# EasyEDA Pro project ProPrj_Ideal Diode_2025-12-23.epro

# Schematic Schematic1
Board Name: Board1; Create Date: 2025-12-15; Page Name: P1; Project Name: Ideal Diode; Schematic Name: Schematic1; Update Date: 2025-12-15; Company: EasyEDA.com; Page Size: A4; Version: V1.0
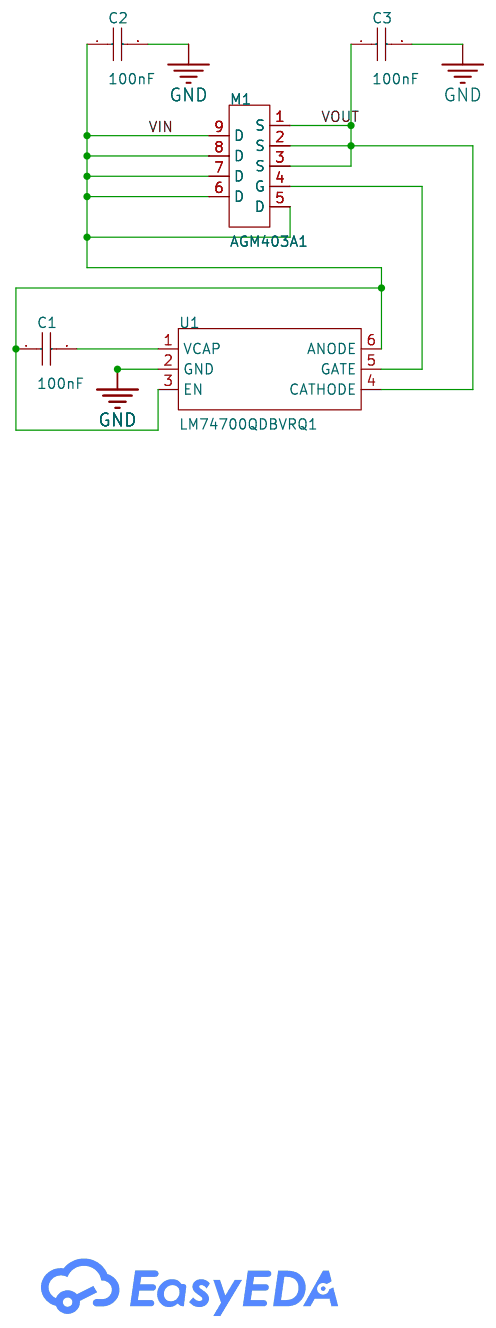
[diagram p0: schematic sheet]

## Parts
C1  100nF  [C0402]
C2  100nF  [C0402]
C3  100nF  [C0402]
M1  AGM403A1  [DFN-8_L5.8-W4.9-P1.27-LS6.0-BL-1]
U1  LM74700QDBVRQ1  [SOT-23-6_L2.9-W1.6-P0.95-LS2.8-BL]

## Library data of the parts
C1-C3 = 0402F104M500NT: Capacitance:100nF Tolerance:±20% Tolerance:±20% Voltage Rating:50V Temperature Coefficient:Y5V; LCSC Part Name: 100nF ±20% 50V; Supplier Part: C1581; Manufacturer: FH(风华); Supplier Footprint: 0402; JLCPCB Part Class: Extended Part; Datasheet: https://atta.szlcsc.com/upload/public/pdf/source/20200305/C486355_26A10D38EF8C2A5C37091D0039909270.pdf; Supplier: LCSC; Tolerance: ±20%; Voltage Rating: 50V; Temperature Coefficient: Y5V
M1 = AGM403A1: Number:1 N-Channel Drain to Source Voltage:40V Current - Continuous Drain(Id):120A RDS(on):2.3mΩ@10V Pd - Power Dissipation:83W Gate Threshold Voltage (Vgs(th)):1.6V@250uA Gate Charge(Qg):20nC@10V Input Capacitance(Ciss):5.189nF@20V Reverse Transfer Capac; LCSC Part Name: 1个N沟道 耐压:40V 电流:120A; Supplier Part: C5184861; Manufacturer: AGMSEMI(芯控源); Supplier Footprint: PDFN-8(5x6); JLCPCB Part Class: Extended Part; Datasheet: https://item.szlcsc.com/datasheet/AGM403A1/5851240.html; Supplier: LCSC; Number: 1 N-Channel; Drain to Source Voltage: 40V; Current - Continuous Drain(Id): 120A; RDS(on): 2.3mΩ@10V; Pd - Power Dissipation: 83W; Gate Threshold Voltage (Vgs(th)): 1.6V@250uA; Gate Charge(Qg): 20nC@10V; Input Capacitance(Ciss): 5.189nF@20V; Reverse Transfer Capacitance (Crss@Vds): 378pF@20V; Operating Temperature: -55℃~+150℃
U1 = LM74700QDBVRQ1_C2941042: LCSC Part Name: 低IQ电池反向保护理想二极管控制器; Supplier Part: C2941042; Manufacturer: TI(德州仪器); Supplier Footprint: SOT-23-6; JLCPCB Part Class: Extended Part; Datasheet: https://www.ti.com/cn/lit/gpn/lm74700-q1; Supplier: LCSC

## Nets
GND: C2.2 C3.2 U1.2(GND)
VIN: C1.1 C2.1 M1.5(D) M1.6(D) M1.7(D) M1.8(D) M1.9(D) U1.3(EN) U1.6(ANODE)
VOUT: C3.1 M1.1(S) M1.2(S) M1.3(S) U1.4(CATHODE)
$1N889: M1.4(G) U1.5(GATE)
$1N950: C1.2 U1.1(VCAP)

# Board PCB1
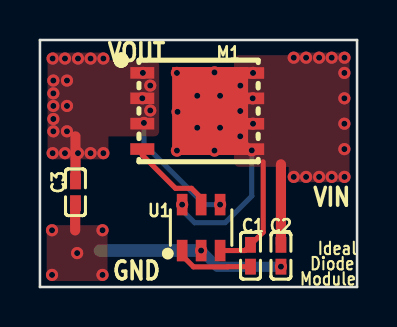
[diagram p1: board, top side]
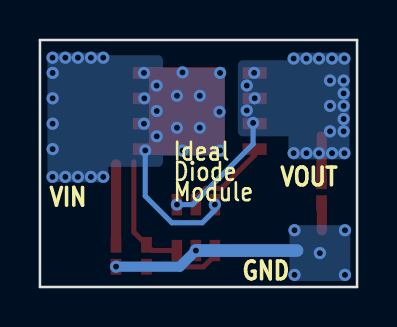
[diagram p2: board, bottom side, seen from below]

Outline 15.88 x 12.35 mm; copper layers: Top Layer, Bottom Layer. Coordinates in mm from the lower left corner of the outline.
Outline path: 0,12.35 0,0 15.88,0 15.88,12.35 0,12.35
Stack: Top Layer 0.035mm / Dielectric1 1.51mm FR4 er 4.5 / Bottom Layer 0.035mm

## Design rules (mm)
template: JLCPCB Capability(Two Layers Board)
spacing copperThickness1oz (default): track to track 0.102, other pairs 0.152 to 0.3
spacing copperThickness2oz: track to track 0.203, other pairs 0.152 to 0.3
track width copperThickness1oz (default): min 0.127, default 0.254, max 2.54
track width copperThickness2oz: min 0.203, default 0.254, max 2.54
differential pair differentialPair (default): width min 0.127, default 0.254, max 2.54; gap min 0.152, default 0.152
via viaSize (default): diameter min 0.5, default 0.61, max 10; hole min 0.3, default 0.305, max 6.3

## Placement (name value [footprint] x y rotation side)
C1  100nF  [C0402]  10.54 1.56 270 top
C2  100nF  [C0402]  12.06 1.56 270 top
C3  100nF  [C0402]  1.78 4.74 270 top
M1  AGM403A1  [DFN-8_L5.8-W4.9-P1.27-LS6.0-BL-1]  7.87 8.8 270 top
U1  LM74700QDBVRQ1  [SOT-23-6_L2.9-W1.6-P0.95-LS2.8-BL]  8.07 2.97 0 top

## Footprints (pads in the part's own frame, mm; a bottom-side part is the same pattern mirrored in y, then rotated)
C0402
  rect 0.79x0.54 smd: 1(-0.545,0) 2(0.545,0)
DFN-8_L5.8-W4.9-P1.27-LS6.0-BL-1
  rect 0.58x1.2 smd: 1(-1.907,-2.75) 2(-0.637,-2.75) 3(0.632,-2.75) 4(1.903,-2.75) 5(1.907,2.75) 6(0.637,2.75) 7(-0.632,2.75) 8(-1.903,2.75)
  rect 4.4x3.8 smd: 9(0,0.646)
SOT-23-6_L2.9-W1.6-P0.95-LS2.8-BL
  rect 0.532x1.072 smd: 1(-0.95,-1.149) 2(0,-1.149) 3(0.95,-1.149) 4(0.95,1.149) 5(0,1.149) 6(-0.95,1.149)

## Nets
As in the schematic.

## Via types
v1: diameter 0.61, hole 0.305, Top Layer to Bottom Layer, 62 vias

## Routing (per net, layer and track width the routed paths; a pad name or vN(x,y) marks a point on that pad's centre or on a via; arc(x,y) is an arc through that point)
GND: length 10.8
  Top Layer w0.508: 1.76,2.83 1.76,4.18 C3.2
  Bottom Layer w0.508: v1(12.06,1.02) 8.87,1.02 v1(8.07,1.82)
  Bottom Layer w0.635: 3,1.82 v1(8.07,1.82)
  vias: v1(0.6,2.84) v1(0.6,0.61) v1(1.86,1.7) v1(3.13,2.84) v1(3.13,0.61)
VIN: length 20
  Top Layer w0.254: M1.5 10.59,6.89 9.02,8.47 9.02,8.76 8.97,8.8 M1.9 ; U1.3 10.26,1.82 C1.1 11.18,2.74 11.18,6.26
  Top Layer w0.508: C2.1 12.06,6.14
  Bottom Layer w0.254: v1(10.6,6.83) 10.6,4.55 9.27,3.21 7.75,3.21 7.12,3.84 v1(7.12,4.12)
  vias: v1(6.86,10.71) v1(6.89,8.76) v1(6.86,6.82) v1(7.87,9.56) v1(7.87,7.97) v1(8.74,10.73) v1(8.74,6.82) v1(9.02,9.56) v1(9.02,7.97) v1(10.03,10.07) v1(10.03,8.8) v1(10.03,7.54) v1(10.67,10.71) v1(10.65,9.44) v1(10.67,8.17) v1(12.71,11.47) v1(12.71,5.51) v1(13.32,11.47) v1(13.32,5.51) v1(13.98,11.47) v1(13.98,5.51) v1(14.6,11.47) v1(14.6,5.51) v1(15.25,11.47) v1(15.24,10.71) v1(15.24,9.44) v1(15.24,8.17) v1(15.24,6.9) v1(15.25,5.51)
VOUT: length 8.4
  Top Layer w0.508: C3.1 1.78,7.53
  Bottom Layer w0.254: v1(9.02,4.12) 8.24,4.12 5.21,7.15 v1(5.21,8.21)
  vias: v1(0.63,11.43) v1(0.63,6.69) v1(0.67,10.33) v1(0.67,9.69) v1(0.67,9.06) v1(0.67,8.4) v1(0.67,7.79) v1(1.25,11.43) v1(1.25,6.69) v1(1.35,10.33) v1(1.35,9.06) v1(1.35,7.79) v1(1.91,11.43) v1(1.91,6.69) v1(2.53,11.43) v1(2.53,6.69) v1(3.18,11.43) v1(3.18,6.69) v1(5.12,9.44) v1(5.15,10.71) v1(5.52,10.07) v1(5.52,8.83)
$1N889: length 4.5
  Top Layer w0.254: M1.4 5.12,6.6 6.79,4.94 7.59,4.94 8.07,4.45 U1.5
$1N950: length 3.9
  Top Layer w0.254: C1.2 9.41,1.02 9.4,1.01 7.69,1.01 7.12,1.58 U1.1

## Copper pours and planes (outline as drawn; the poured copper is in the pictures)
GND on Top Layer: 0.34,3.09 3.39,3.09 3.39,0.3 0.34,0.3
GND on Bottom Layer: 0.34,3.09 3.39,3.09 3.39,0.3 0.34,0.3
VIN on Top Layer: 9.72,11.6 13.4,11.6 13.4,6.01 9.72,6.01
VIN on Top Layer: 12.45,11.72 15.5,11.72 15.5,5.25 12.45,5.25
VIN on Bottom Layer: 12.45,11.72 15.5,11.72 15.5,5.25 12.45,5.25
VIN on Bottom Layer: 9.72,11.6 13.4,11.6 13.4,6.01 9.72,6.01
VIN on Bottom Layer: 6.61,10.96 10.41,10.96 10.41,6.56 6.61,6.56
VOUT on Top Layer: 2.92,11.34 5.97,11.34 5.97,7.53 2.92,7.53
VOUT on Top Layer: 0.38,11.72 3.43,11.72 3.43,6.39 0.38,6.39
VOUT on Bottom Layer: 2.92,11.34 5.97,11.34 5.97,7.53 2.92,7.53
VOUT on Bottom Layer: 0.38,11.72 3.43,11.72 3.43,6.39 0.38,6.39

## Text on the board
Bottom Silkscreen Layer: Ideal | Diode | Module | VOUT | GND | VIN
Top Silkscreen Layer: Module | Diode | Ideal | VOUT | GND | VIN
